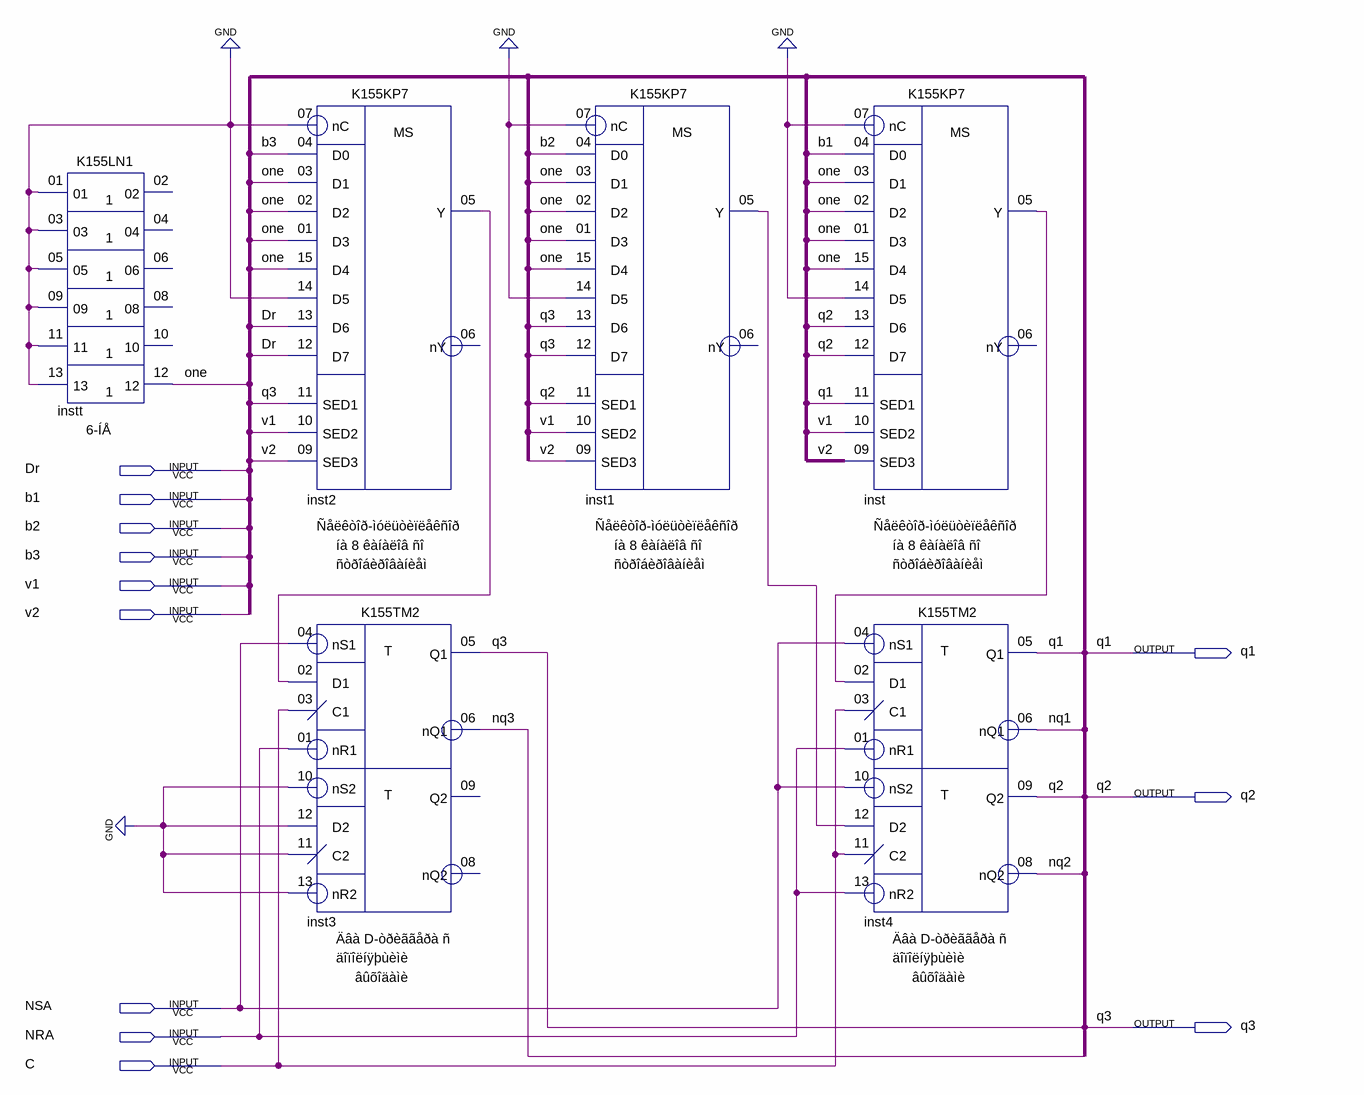
[diagram p0: schematic sheet]
// Quartus schematic scheme.bdf as structural Verilog: 6 symbols, 12 pins
module scheme (
  input  Dr,
  input  b1,
  input  b2,
  input  b3,
  input  v1,
  input  v2,
  input  NSA,
  input  NRA,
  input  C,
  output q1,
  output q2,
  output q3
);

  wire inst1_y, inst2_y, inst_y, nq1, nq2, nq3, one;

  K155LN1 instt (
    .\01 (1'b0), .\03 (1'b0), .\05 (1'b0), .\09 (1'b0), .\11 (1'b0), .\13 (1'b0), .\12 (one));  // open: 02, 04, 06, 08, 10
  K155KP7 inst2 (
    .nC(1'b0), .D0(b3), .D1(one), .D2(one), .D3(one), .D4(one), .D5(1'b0), .D6(Dr), .D7(Dr), .SED1(q3),
    .SED2(v1), .SED3(v2), .Y(inst2_y));  // open: nY
  K155TM2 inst3 (
    .nS1(NSA), .nR1(NRA), .C1(C), .D1(inst2_y), .nS2(1'b0), .nR2(1'b0), .C2(1'b0), .D2(1'b0), .Q1(q3),
    .nQ1(nq3));  // open: Q2, nQ2
  K155KP7 inst1 (
    .nC(1'b0), .D0(b2), .D1(one), .D2(one), .D3(one), .D4(one), .D5(1'b0), .D6(q3), .D7(q3), .SED1(q2),
    .SED2(v1), .SED3(v2), .Y(inst1_y));  // open: nY
  K155KP7 inst (
    .nC(1'b0), .D0(b1), .D1(one), .D2(one), .D3(one), .D4(one), .D5(1'b0), .D6(q2), .D7(q2), .SED1(q1),
    .SED2(v1), .SED3(v2), .Y(inst_y));  // open: nY
  K155TM2 inst4 (
    .nS1(NSA), .nR1(NRA), .C1(C), .D1(inst_y), .nS2(NSA), .nR2(NRA), .C2(C), .D2(inst1_y), .Q1(q1),
    .nQ1(nq1), .Q2(q2), .nQ2(nq2));
endmodule
